# EAGLE schematic cpu_board (EAGLE 6.4)
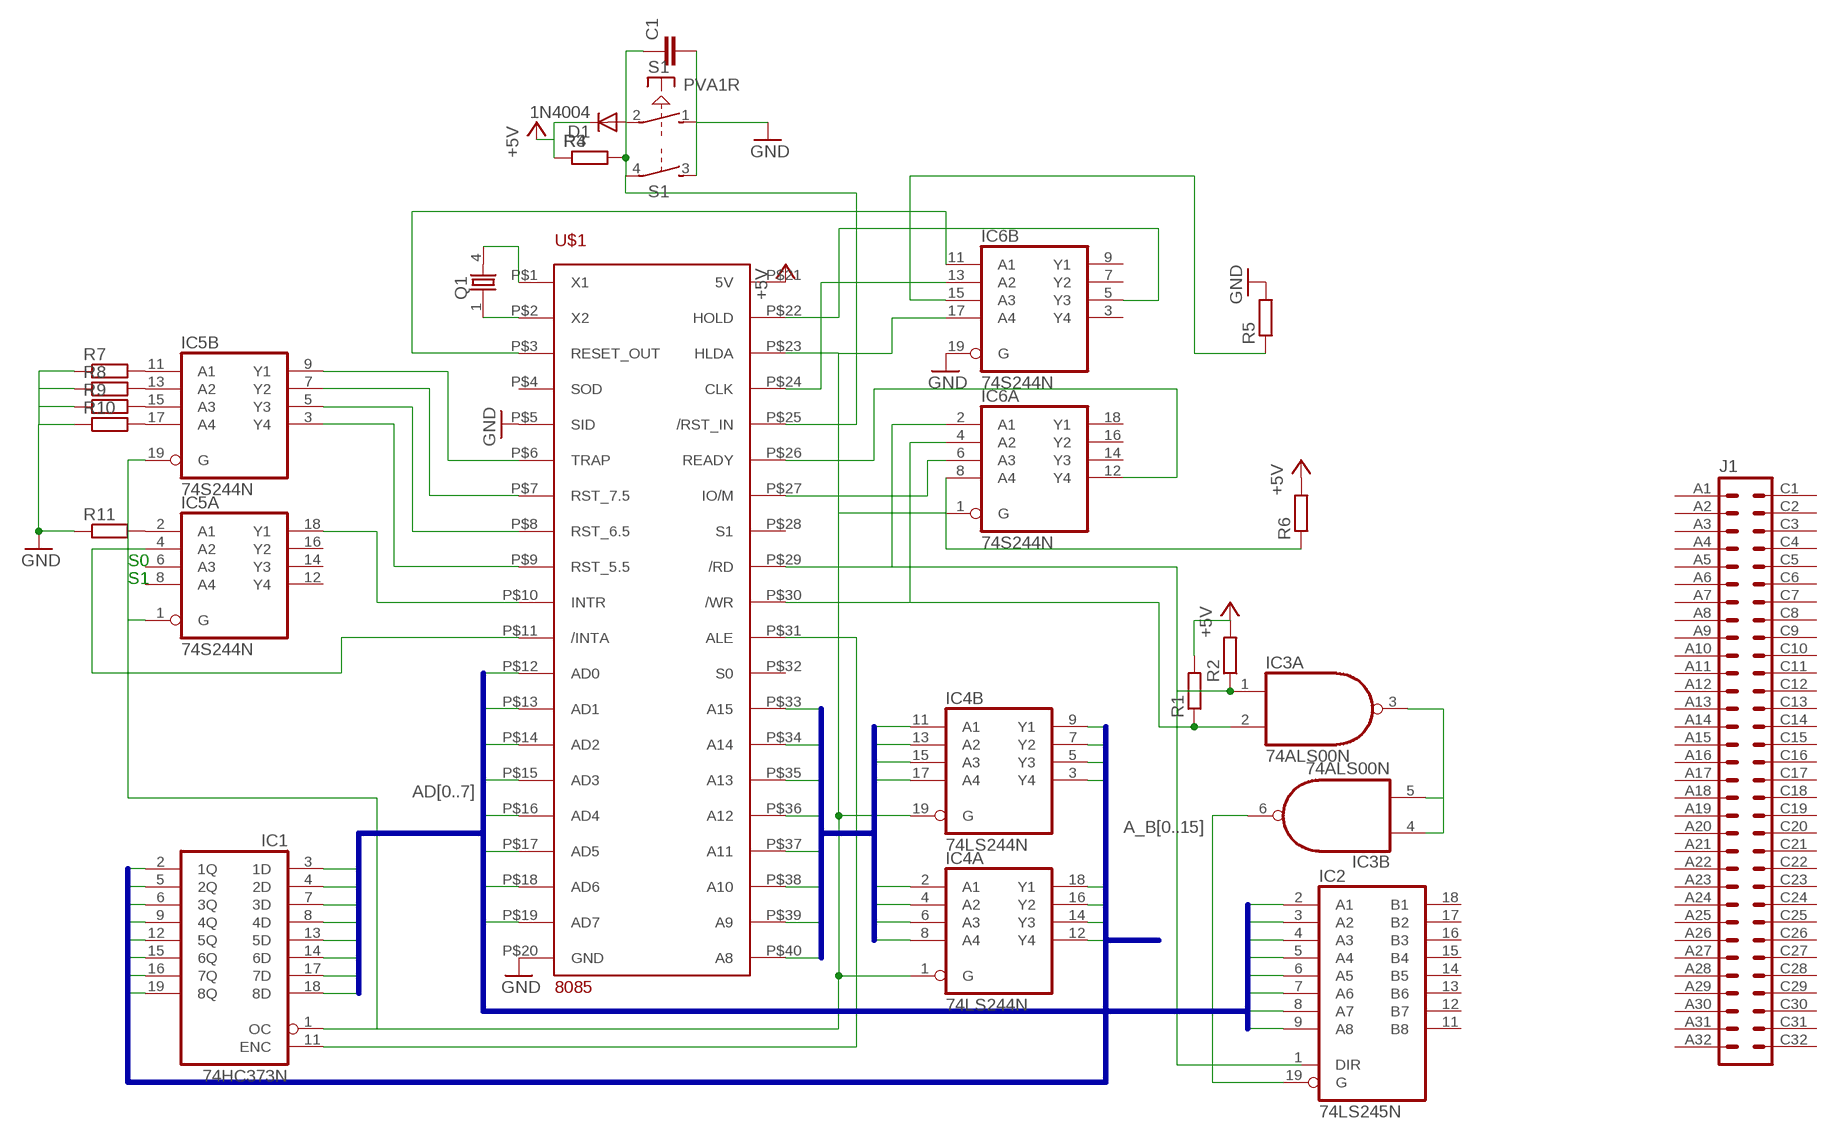
[diagram p0: schematic, sheet 1]

## Parts
C1  C-EU025-025X050  [C025-025X050]
D1  1N4004  [DO41-10]
IC1  74HC373N  [DIL20]
IC2  74LS245N  [DIL20]
IC3  74ALS00N  [DIL14]
IC4  74LS244N  [DIL20]
IC5  74S244N  [DIL20]
IC6  74S244N  [DIL20]
J1  VG64  [VG64]
Q1  86SMX  [86SMX]
R1  R-EU_VTA52  [VTA52]
R2  R-EU_VTA52  [VTA52]
R3  R-EU_0204/2V  [0204V]
R4  R-EU_0204/2V  [0204V]
R5  R-EU_0204/2V  [0204V]
R6  R-EU_0204/2V  [0204V]
R7  R-EU_0613/5V  [P0613V]
R8  R-EU_0613/5V  [P0613V]
R9  R-EU_0613/5V  [P0613V]
R10  R-EU_0613/5V  [P0613V]
R11  R-EU_0613/5V  [P0613V]
S1  PVA1R  [PVA1R]
U$1  8085  [8085]

## Nets
+5V: D1.C R1.2 R2.2 R3.1 R4.1 R6.2 U$1.P$21(5V)
A8: IC4.2(A:A1) U$1.P$40(A8)
A9: IC4.4(A:A2) U$1.P$39(A9)
A10: IC4.6(A:A3) U$1.P$38(A10)
A11: IC4.8(A:A4) U$1.P$37(A11)
A12: IC4.11(B:A1) U$1.P$36(A12)
A13: IC4.13(B:A2) U$1.P$35(A13)
A14: IC4.15(B:A3) U$1.P$34(A14)
A15: IC4.17(B:A4) U$1.P$33(A15)
A_B0: IC1.2(1Q)
A_B1: IC1.5(2Q)
A_B2: IC1.6(3Q)
A_B3: IC1.9(4Q)
A_B4: IC1.12(5Q)
A_B5: IC1.15(6Q)
A_B6: IC1.16(7Q)
A_B7: IC1.19(8Q)
A_B8: IC4.18(A:Y1)
A_B9: IC4.16(A:Y2)
A_B10: IC4.14(A:Y3)
A_B11: IC4.12(A:Y4)
A_B12: IC4.9(B:Y1)
A_B13: IC4.7(B:Y2)
A_B14: IC4.5(B:Y3)
A_B15: IC4.3(B:Y4)
AD0: IC1.3(1D) IC2.2(A1) U$1.P$12(AD0)
AD1: IC1.4(2D) IC2.3(A2) U$1.P$13(AD1)
AD2: IC1.7(3D) IC2.4(A3) U$1.P$14(AD2)
AD3: IC1.8(4D) IC2.5(A4) U$1.P$15(AD3)
AD4: IC1.13(5D) IC2.6(A5) U$1.P$16(AD4)
AD5: IC1.14(6D) IC2.7(A6) U$1.P$17(AD5)
AD6: IC1.17(7D) IC2.8(A7) U$1.P$18(AD6)
AD7: IC1.18(8D) IC2.9(A8) U$1.P$19(AD7)
GND: IC6.19(B:G) R5.2 U$1.P$5(SID) U$1.P$20(GND)
N$1: IC1.1(OC) IC4.1(A:G) IC4.19(B:G) IC6.1(A:G) IC6.17(B:A4) U$1.P$23(HLDA)
N$2: IC3.1(A:I0) IC6.2(A:A1) R2.1 U$1.P$29(/RD)
N$3: IC3.3(A:O) IC3.4(B:I0) IC3.5(B:I1)
N$4: IC2.19(G) IC3.6(B:O)
N$5: IC3.2(A:I1) IC6.4(A:A2) R1.1 U$1.P$30(/WR)
N$6: C1.1 D1.A R3.2 R4.2 S1.2(1:P) S1.4(2:P) U$1.P$25(/RST_IN)
N$7: IC5.1(A:G) IC5.19(B:G)
N$8: IC6.11(B:A1) U$1.P$3(RESET_OUT)
N$9: Q1.1 U$1.P$2(X2)
N$10: Q1.4 U$1.P$1(X1)
N$11: IC1.11(ENC) U$1.P$31(ALE)
N$12: IC6.13(B:A2) U$1.P$24(CLK)
N$13: IC6.5(B:Y3) U$1.P$22(HOLD)
N$14: C1.2 S1.1(1:S) S1.3(2:S) ; supply symbol labelled GND
N$15: IC6.15(B:A3) R5.1
N$16: IC6.6(A:A3) U$1.P$27(IO/M)
N$17: IC5.9(B:Y1) U$1.P$6(TRAP)
N$18: IC5.7(B:Y2) U$1.P$7(RST_7.5)
N$19: IC6.12(A:Y4) U$1.P$26(READY)
N$20: IC6.8(A:A4) R6.1
N$21: IC5.5(B:Y3) U$1.P$8(RST_6.5)
N$22: IC5.3(B:Y4) U$1.P$9(RST_5.5)
N$23: IC5.18(A:Y1) U$1.P$10(INTR)
N$24: IC5.11(B:A1) R7.2
N$25: IC5.13(B:A2) R8.2
N$26: IC5.15(B:A3) R9.2
N$27: IC5.17(B:A4) R10.2
N$28: IC5.2(A:A1) R11.2
N$29: R7.1 R8.1 R9.1 R10.1 R11.1 ; supply symbol labelled GND
N$30: IC5.4(A:A2) U$1.P$11(/INTA)
Unconnected: IC2.1(DIR) IC2.11(B8) IC2.12(B7) IC2.13(B6) IC2.14(B5) IC2.15(B4) IC2.16(B3) IC2.17(B2) IC2.18(B1) IC3.8(C:O) IC3.9(C:I0) IC3.10(C:I1) IC3.11(D:O) IC3.12(D:I0) IC3.13(D:I1) IC5.6(A:A3) IC5.8(A:A4) IC5.12(A:Y4) IC5.14(A:Y3) IC5.16(A:Y2) IC6.3(B:Y4) IC6.7(B:Y2) IC6.9(B:Y1) IC6.14(A:Y3) IC6.16(A:Y2) IC6.18(A:Y1) J1.A1 J1.A2 J1.A3 J1.A4 J1.A5 J1.A6 J1.A7 J1.A8 J1.A9 J1.A10 J1.A11 J1.A12 J1.A13 J1.A14 J1.A15 J1.A16 J1.A17 J1.A18 J1.A19 J1.A20 J1.A21 J1.A22 J1.A23 J1.A24 J1.A25 J1.A26 J1.A27 J1.A28 J1.A29 J1.A30 J1.A31 J1.A32 J1.C1 J1.C2 J1.C3 J1.C4 J1.C5 J1.C6 J1.C7 J1.C8 J1.C9 J1.C10 J1.C11 J1.C12 J1.C13 J1.C14 J1.C15 J1.C16 J1.C17 J1.C18 J1.C19 J1.C20 J1.C21 J1.C22 J1.C23 J1.C24 J1.C25 J1.C26 J1.C27 J1.C28 J1.C29 J1.C30 J1.C31 J1.C32 U$1.P$4(SOD) U$1.P$28(S1) U$1.P$32(S0)

## Buses
AD[0..7]
A[8..15]
A_B[0..15]

## Notes on the sheet
- S0
- S1

## Power pins joined to a net without a drawn wire
GND: IC1.10(GND) IC2.10(GND) IC3.7(P:GND) IC4.10(P:GND) IC5.10(P:GND) IC6.10(P:GND)
VCC: IC1.20(VCC) IC2.20(VCC) IC3.14(P:VCC) IC4.20(P:VCC) IC5.20(P:VCC) IC6.20(P:VCC)

## Library data of the parts
C1 = rcl:C-EU: CAPACITOR, European symbol
D1 = diode:1N4004: DIODE general purpose rectifier, 1 A
IC1 = 74xx-eu:74*373: Octal D type transparent LATCH, edge triggered
IC2 = 74xx-us:74*245: Octal BUS TRANSCEIVER, 3-state
IC3 = 74xx-us:74*00: Quad 2-input NAND gate
IC4-IC6 = 74xx-us:74*244: Octal BUFFER and LINE DRIVER, 3-state
J1 = 19inch:VG64: PCB EUROCARD, 64-pin type C/AC, 2.54 mm
Q1 = crystal:86SMX: CRYSTAL; MF: C-MAC FREQUENCY PRODUCTS LTD; MPN: XTAL003321- 86SMX; OC_FARNELL: 6344914; OC_NEWARK: 01H9866
R1-R11 = rcl:R-EU_: RESISTOR, European symbol
S1 = switch-misc:PVA1R: ITT SWITCH
U$1 = custom:8085